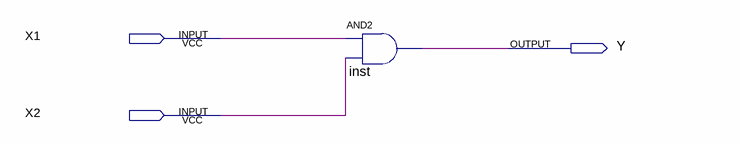
[diagram p0: schematic sheet]
// Quartus schematic test1.bdf as structural Verilog: 1 symbols, 3 pins
module test1 (
  input  X1,
  input  X2,
  output Y
);

  and inst (Y, X1, X2);
endmodule
